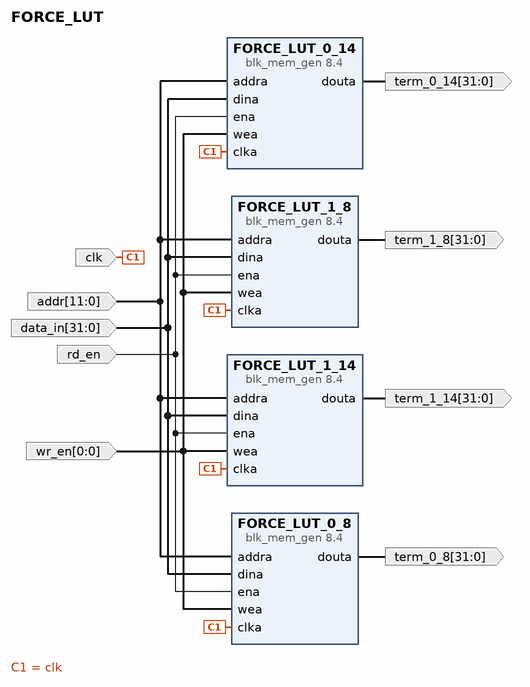
[diagram p0: block diagram of the top level]
# Vivado block design FORCE_LUT, xcu280-fsvh2892-2L-e, Vivado 2021.2
create_bd_design FORCE_LUT

create_bd_port -dir I -from 11 -to 0 addr
create_bd_port -dir I -type clk clk
create_bd_port -dir I -from 31 -to 0 data_in
create_bd_port -dir I rd_en
create_bd_port -dir O -from 31 -to 0 term_0_8
create_bd_port -dir O -from 31 -to 0 term_0_14
create_bd_port -dir O -from 31 -to 0 term_1_8
create_bd_port -dir O -from 31 -to 0 term_1_14
create_bd_port -dir I -from 0 -to 0 wr_en

create_bd_cell -type ip -vlnv xilinx.com:ip:blk_mem_gen:8.4 FORCE_LUT_0_8
set_property -dict [list \
  CONFIG.Coe_File ../../../../../../../InterFPGA_MD/Benchmark_kernel/src/mem_init/c0_8.coe \
  CONFIG.Collision_Warnings NONE \
  CONFIG.Disable_Collision_Warnings true \
  CONFIG.Disable_Out_of_Range_Warnings true \
  CONFIG.Enable_32bit_Address false \
  CONFIG.Enable_A Use_ENA_Pin \
  CONFIG.Load_Init_File true \
  CONFIG.Operating_Mode_A NO_CHANGE \
  CONFIG.Register_PortA_Output_of_Memory_Primitives true \
  CONFIG.Use_Byte_Write_Enable false \
  CONFIG.Use_RSTA_Pin false \
  CONFIG.Write_Depth_A 2560 \
  CONFIG.use_bram_block Stand_Alone \
] [get_bd_cells FORCE_LUT_0_8]
create_bd_cell -type ip -vlnv xilinx.com:ip:blk_mem_gen:8.4 FORCE_LUT_0_14
set_property -dict [list \
  CONFIG.Coe_File ../../../../../../../InterFPGA_MD/Benchmark_kernel/src/mem_init/c0_14.coe \
  CONFIG.Collision_Warnings NONE \
  CONFIG.Disable_Collision_Warnings true \
  CONFIG.Disable_Out_of_Range_Warnings true \
  CONFIG.Enable_32bit_Address false \
  CONFIG.Enable_A Use_ENA_Pin \
  CONFIG.Load_Init_File true \
  CONFIG.Operating_Mode_A NO_CHANGE \
  CONFIG.Register_PortA_Output_of_Memory_Primitives true \
  CONFIG.Use_Byte_Write_Enable false \
  CONFIG.Use_RSTA_Pin false \
  CONFIG.Write_Depth_A 2560 \
  CONFIG.use_bram_block Stand_Alone \
] [get_bd_cells FORCE_LUT_0_14]
create_bd_cell -type ip -vlnv xilinx.com:ip:blk_mem_gen:8.4 FORCE_LUT_1_8
set_property -dict [list \
  CONFIG.Coe_File ../../../../../../../InterFPGA_MD/Benchmark_kernel/src/mem_init/c1_8.coe \
  CONFIG.Collision_Warnings NONE \
  CONFIG.Disable_Collision_Warnings true \
  CONFIG.Disable_Out_of_Range_Warnings true \
  CONFIG.Enable_32bit_Address false \
  CONFIG.Enable_A Use_ENA_Pin \
  CONFIG.Load_Init_File true \
  CONFIG.Operating_Mode_A NO_CHANGE \
  CONFIG.Register_PortA_Output_of_Memory_Primitives true \
  CONFIG.Use_Byte_Write_Enable false \
  CONFIG.Use_RSTA_Pin false \
  CONFIG.Write_Depth_A 2560 \
  CONFIG.use_bram_block Stand_Alone \
] [get_bd_cells FORCE_LUT_1_8]
create_bd_cell -type ip -vlnv xilinx.com:ip:blk_mem_gen:8.4 FORCE_LUT_1_14
set_property -dict [list \
  CONFIG.Coe_File ../../../../../../../InterFPGA_MD/Benchmark_kernel/src/mem_init/c1_14.coe \
  CONFIG.Collision_Warnings NONE \
  CONFIG.Disable_Collision_Warnings true \
  CONFIG.Disable_Out_of_Range_Warnings true \
  CONFIG.Enable_32bit_Address false \
  CONFIG.Enable_A Use_ENA_Pin \
  CONFIG.Load_Init_File true \
  CONFIG.Operating_Mode_A NO_CHANGE \
  CONFIG.Register_PortA_Output_of_Memory_Primitives true \
  CONFIG.Use_Byte_Write_Enable false \
  CONFIG.Use_RSTA_Pin false \
  CONFIG.Write_Depth_A 2560 \
  CONFIG.use_bram_block Stand_Alone \
] [get_bd_cells FORCE_LUT_1_14]

# ---- connections ----

connect_bd_net [get_bd_pins FORCE_LUT_0_14/douta] [get_bd_ports term_0_14]
connect_bd_net [get_bd_pins FORCE_LUT_0_8/douta] [get_bd_ports term_0_8]
connect_bd_net [get_bd_pins FORCE_LUT_1_14/douta] [get_bd_ports term_1_14]
connect_bd_net [get_bd_pins FORCE_LUT_1_8/douta] [get_bd_ports term_1_8]
connect_bd_net -net addra_0_1 [get_bd_ports addr] \
  [get_bd_pins FORCE_LUT_0_14/addra] [get_bd_pins FORCE_LUT_0_8/addra] [get_bd_pins FORCE_LUT_1_14/addra] \
  [get_bd_pins FORCE_LUT_1_8/addra]
connect_bd_net -net clka_0_1 [get_bd_ports clk] \
  [get_bd_pins FORCE_LUT_0_14/clka] [get_bd_pins FORCE_LUT_0_8/clka] [get_bd_pins FORCE_LUT_1_14/clka] \
  [get_bd_pins FORCE_LUT_1_8/clka]
connect_bd_net -net dina_0_1 [get_bd_ports data_in] \
  [get_bd_pins FORCE_LUT_0_14/dina] [get_bd_pins FORCE_LUT_0_8/dina] [get_bd_pins FORCE_LUT_1_14/dina] \
  [get_bd_pins FORCE_LUT_1_8/dina]
connect_bd_net -net ena_0_1 [get_bd_ports rd_en] \
  [get_bd_pins FORCE_LUT_0_14/ena] [get_bd_pins FORCE_LUT_0_8/ena] [get_bd_pins FORCE_LUT_1_14/ena] \
  [get_bd_pins FORCE_LUT_1_8/ena]
connect_bd_net -net wea_0_1 [get_bd_ports wr_en] \
  [get_bd_pins FORCE_LUT_0_14/wea] [get_bd_pins FORCE_LUT_0_8/wea] [get_bd_pins FORCE_LUT_1_14/wea] \
  [get_bd_pins FORCE_LUT_1_8/wea]

validate_bd_design
save_bd_design
